# EAGLE design led (EAGLE 9.5.2)
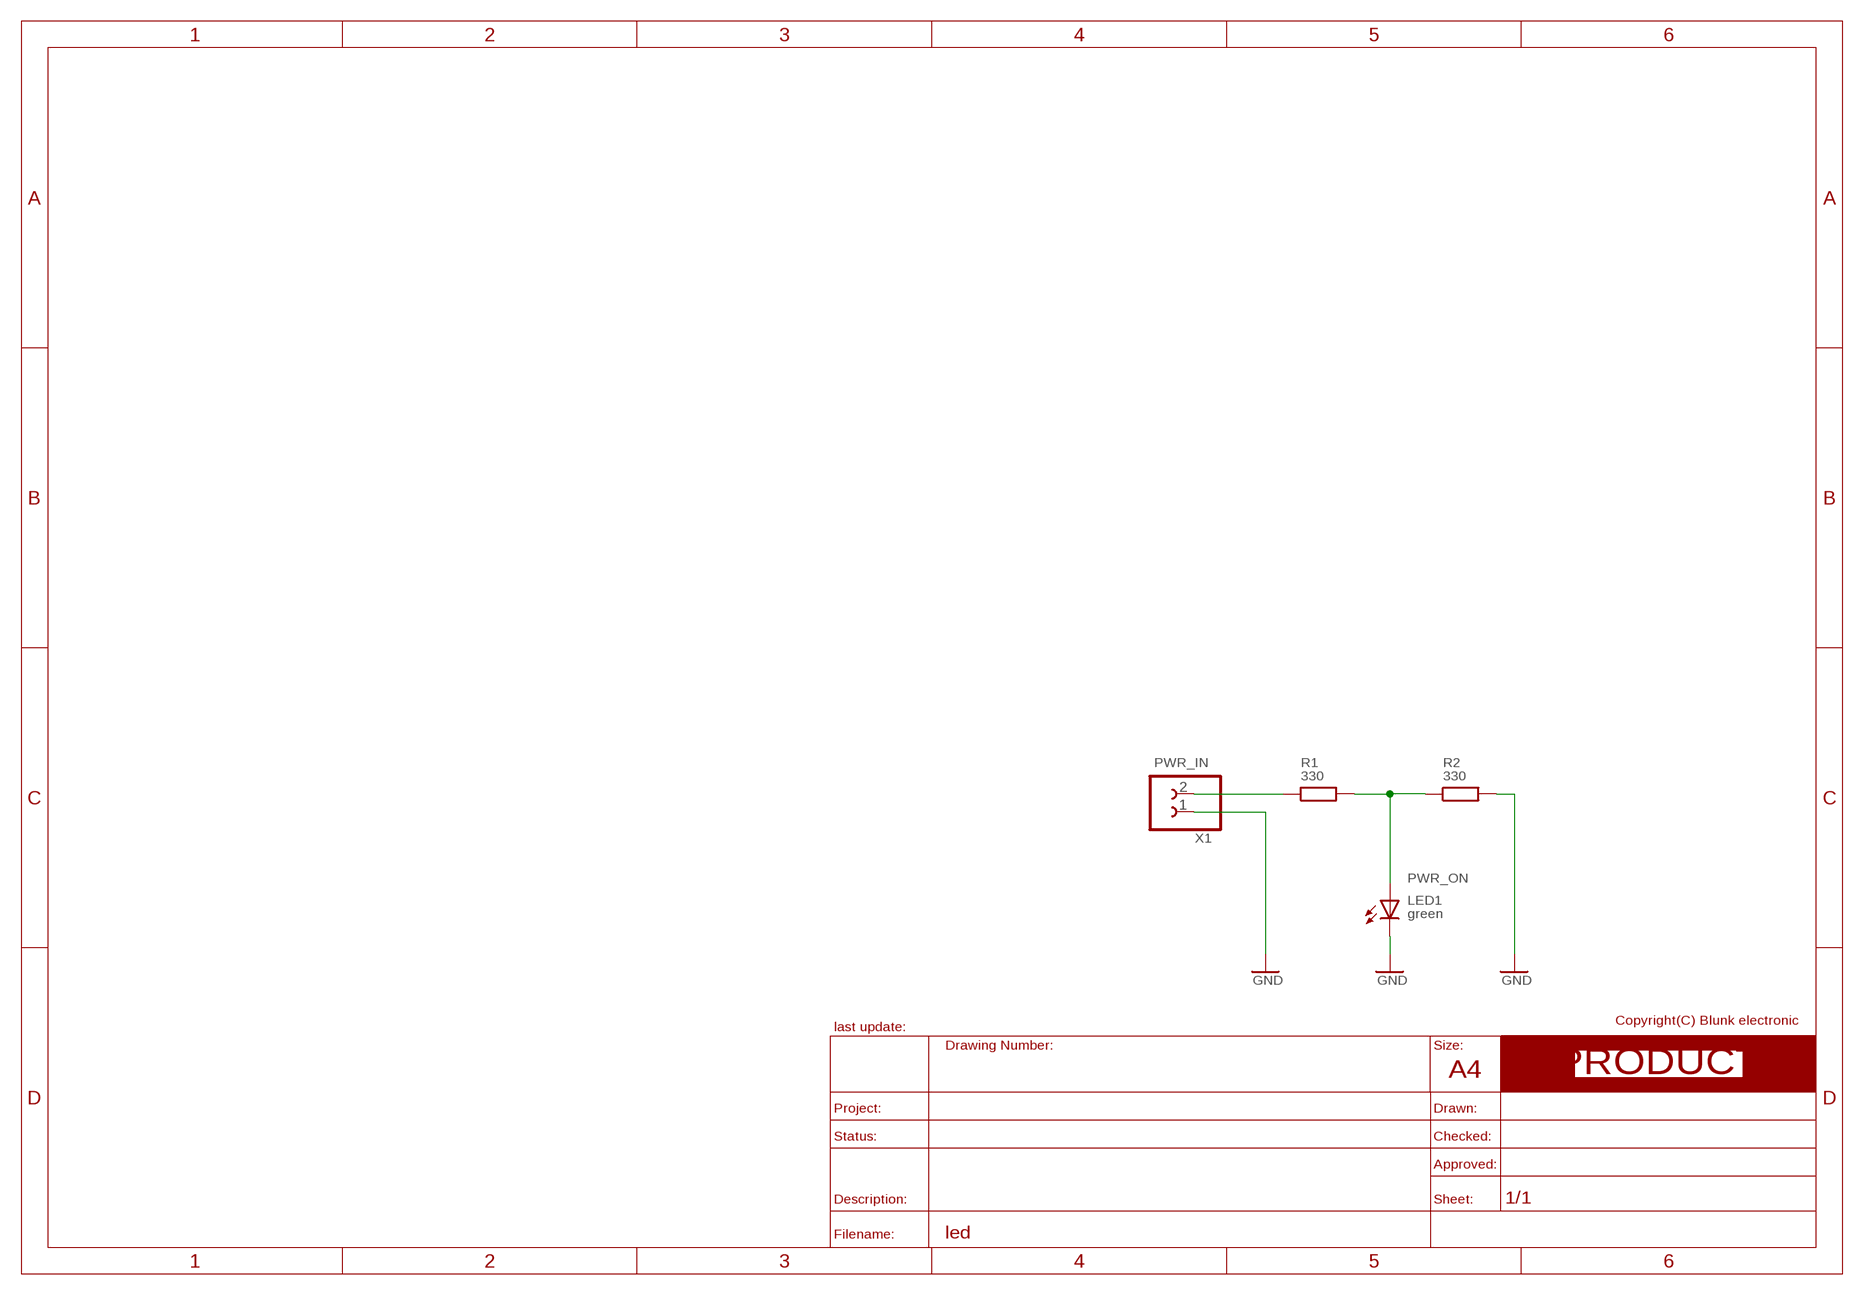
[diagram p0: schematic, sheet 1]
FRAME_PRODUCT1 (A4_LANDSCAPE_PRODUCT): BOM: NO; COMMISSIONED: 2013-08-30

## Parts
LED1  green  LED_S_0805  [S_0805]
R1  330  R_S_0805  [S_0805]
R2  330  R_S_0805  [S_0805]
X1  CLAMP_1X2-T-2.5MM  [T_WIRE_CLAMP_1X2_PITCH_2MM5]

## Nets
GND: LED1.C R2.2 X1.1
LED_A: LED1.A R1.2 R2.1
PWR_IN: R1.1 X1.2

## Library data of the parts
LED1 = be_opt:LED: single LED device drawn: Mario Blunk / Blunk electronic; BOM: YES; COMMISSIONED: 2013-08-30; FUNCTION: PWR_ON; PART_CODE_BEL: LED_PAC_S_0805_VAL_green
R1 R2 = be_rcl:R: edited: Mario Blunk / Blunk electronic; BOM: YES; COMMISSIONED: 2013-08-30; PART_CODE_BEL: R_PAC_S_0805_VAL_330
X1 = be_con_jump:CLAMP_1X2: drawn: Mario Blunk / Blunk electronic; BOM: YES; COMMISSIONED: 2014-04-14; FUNCTION: PWR_IN; PART_CODE_BEL: X_PAC_T_CLAMP_1X2_PITCH_2mm5

## Board
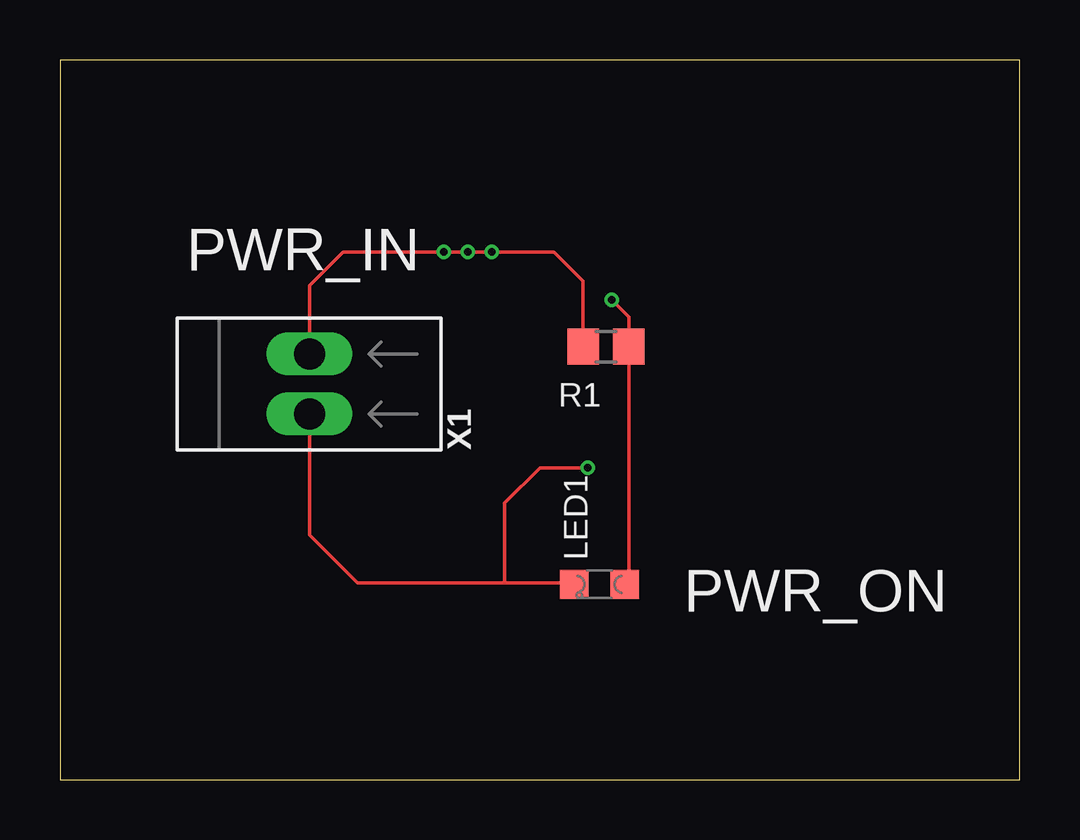
[diagram p1: board, top side]
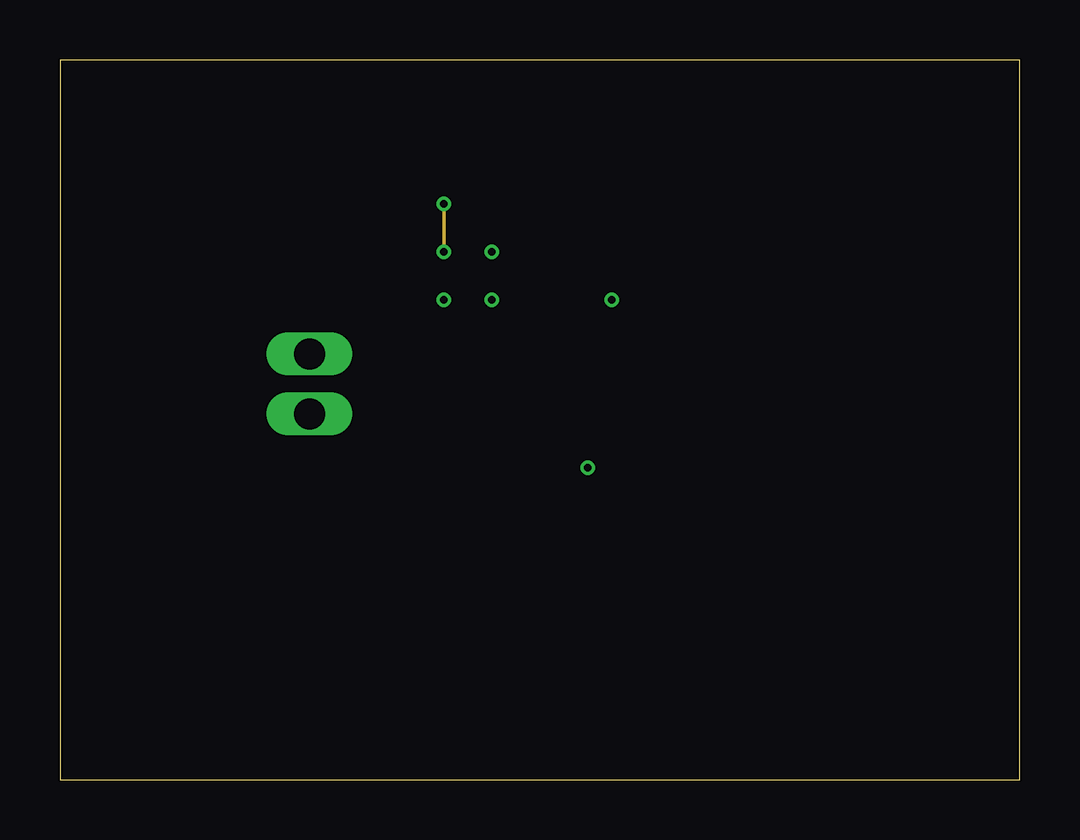
[diagram p2: board, inner layer Route15]
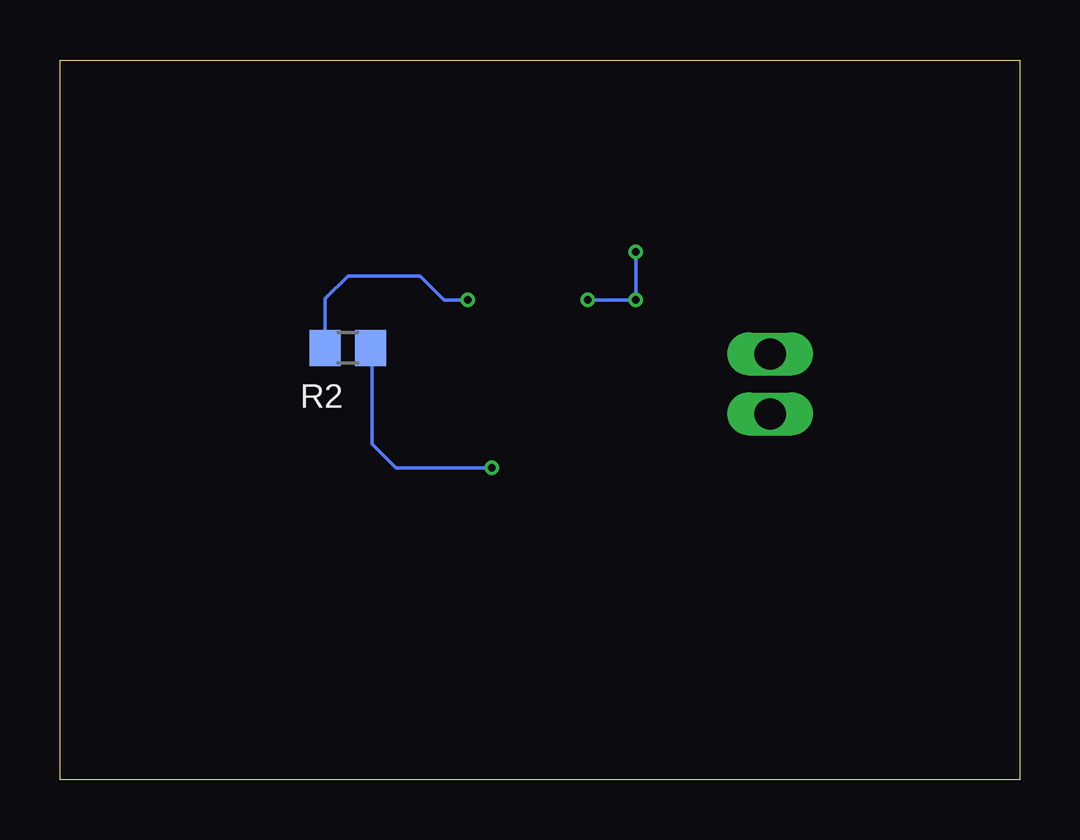
[diagram p3: board, bottom side, seen from below]

Size 40 x 30 mm. Coordinates in mm from the lower left corner, seen from the top.
Outline: 0,0 40,0 40,30 0,30 0,0
Copper layers [15:(1+(2*15)+16):2]: Top 0.018mm / dielectric 0.1mm / Route2 0.035mm / dielectric 1.2mm / Route15 0.035mm / dielectric 0.1mm / Bottom 0.018mm
Design rules "JLP_ML4_std_buried_blind": minimum track width 0.15mm, minimum drill 0.3mm, track to track 0.15mm, track to pad 0.15mm, pad to pad 0.15mm, via to via 0.15mm, smd to smd 0.15mm, copper to edge 0.5mm, drill to drill 0.2mm, minimum pad ring 0.15mm, minimum via ring 0.15mm, stop-mask expansion 0.075mm, vias tented up to drill 0.3mm, thermal gap 0.2mm

### Footprints (pad centres in the part's own frame; a part is rotated, then mirrored left to right if it is on the bottom)
S_0805 = smd 1.2 x 1.2: A 0,-1.05; C 0,1.05
S_0805' = smd 1.3 x 1.5: 1 -0.95,0; 2 0.95,0
T_WIRE_CLAMP_1X2_PITCH_2MM5 = drill 1.3 pad 1.8 long: 1 -1.25,-0.02; 2 1.25,-0.02

### Placement (x,y rotation side)
LED1  22.49,8.14 90 top
R1  330  [S_0805']  22.76,18.05 0 top
R2  330  [S_0805']  28,18 0 bottom
U$1  [A4_LANDSCAPE]  -71,-74 0 top  (outside the outline)
X1  10.38,16.49 90 top

### Tracks (layer width: path | path; a pad name or v marks a point on that pad's centre or on a via)
GND  (via drill 0.3)
  Top 0.15: 18.52,8.2 18.52,11.52 20,13 v22,13
  Top 0.152: X1.1 10.4,10.2 12.4,8.2 18.52,8.2 21.38,8.2 LED1.C
  Bottom 0.15: R2.2 27,18 27,14 26,13 v22,13
LED_A  (via drill 0.3)
  Top 0.15: R1.2 23.71,19.29 v23,20
  Top 0.152: R1.2 23.71,8.31 LED1.A
  Bottom 0.15: R2.1 28.95,20.05 28,21 25,21 24,20 v23,20
PWR_IN  (via drill 0.3, 0.3 layers 1-15, 0.3 layers 1-2, 0.3 layers 15-16, 0.3 layers 2-15, 0.3 layers 2-16)
  Top 0.152: X1.2 10.4,20.6 11.8,22 v16,22 v17,22 v18,22 20.6,22 21.81,20.79 R1.1
  Route15 0.15: v16,22 v16,24
  Bottom 0.15: v16,22 v16,20 v18,20